# EAGLE design nrf51822-bo (EAGLE 6.5.0)
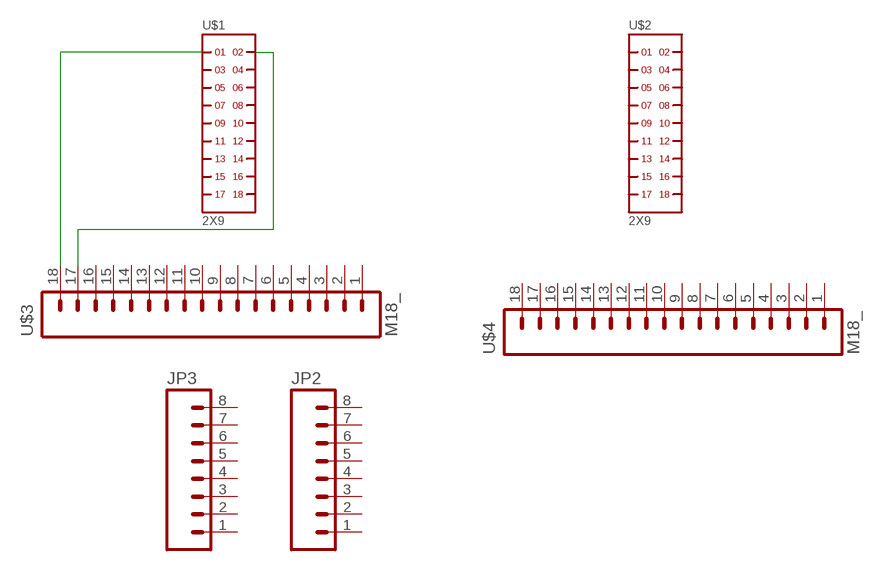
[diagram p0: schematic, sheet 1]

## Parts
JP2  M08  [1X08_PIN1_NO_SILK]
JP3  M08  [1X08_PIN1_NO_SILK]
U$1  2X9  [2X9]
U$2  2X9  [2X9]
U$3  M18_  [1X18]
U$4  M18_  [1X18]

## Nets
N$1: U$1.1 U$3.18
N$2: U$1.2 U$3.17
Unconnected: JP2.1 JP2.2 JP2.3 JP2.4 JP2.5 JP2.6 JP2.7 JP2.8 JP3.1 JP3.2 JP3.3 JP3.4 JP3.5 JP3.6 JP3.7 JP3.8 U$1.3 U$1.4 U$1.5 U$1.6 U$1.7 U$1.8 U$1.9 U$1.10 U$1.11 U$1.12 U$1.13 U$1.14 U$1.15 U$1.16 U$1.17 U$1.18 U$2.1 U$2.2 U$2.3 U$2.4 U$2.5 U$2.6 U$2.7 U$2.8 U$2.9 U$2.10 U$2.11 U$2.12 U$2.13 U$2.14 U$2.15 U$2.16 U$2.17 U$2.18 U$3.1 U$3.2 U$3.3 U$3.4 U$3.5 U$3.6 U$3.7 U$3.8 U$3.9 U$3.10 U$3.11 U$3.12 U$3.13 U$3.14 U$3.15 U$3.16 U$4.1 U$4.2 U$4.3 U$4.4 U$4.5 U$4.6 U$4.7 U$4.8 U$4.9 U$4.10 U$4.11 U$4.12 U$4.13 U$4.14 U$4.15 U$4.16 U$4.17 U$4.18

## Library data of the parts
JP2 JP3 = SparkFun-Connectors:M08: Header 8 Standard 8-pin 0.1" header. Use with straight break away headers (SKU : PRT-00116), right angle break away headers (PRT-00553), swiss pins (PRT-00743), machine pins (PRT-00117), and female headers (PRT-00115).
U$1 U$2 = headers(2mm):2X9
U$3 U$4 = SparkFun-Connectors:M18: 1x18 .1" header

## Board
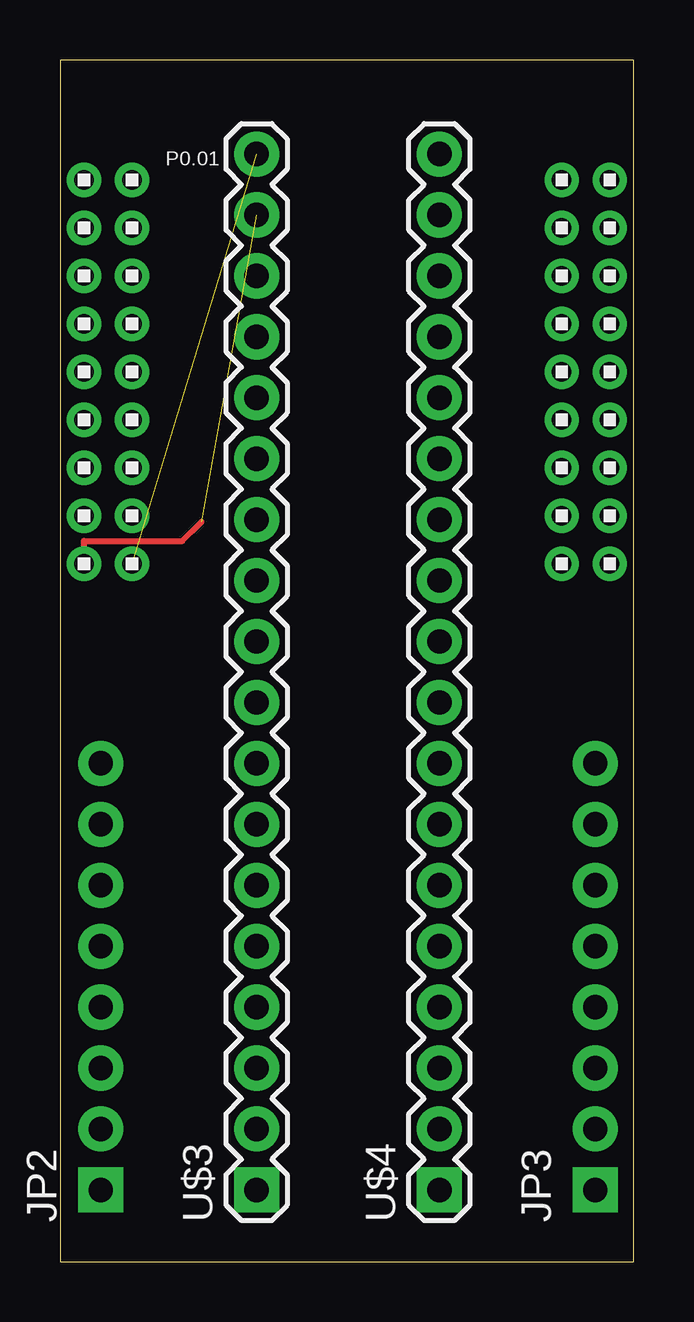
[diagram p1: board, top side]

Size 23.9 x 50.1 mm. Coordinates in mm from the lower left corner, seen from the top.
Outline: 0,0 23.9,0 23.9,50.1 0,50.1 0,0
Copper layers (1*16): Top 0.035mm / dielectric 1.5mm / Bottom 0.035mm
Design rules "default": minimum track width 10mil, minimum drill 24mil, track to track 8mil, track to pad 8mil, pad to pad 8mil, via to via 8mil, smd to smd 8mil, copper to edge 40mil, drill to drill 8mil, minimum pad ring 10mil, minimum via ring 8mil, stop-mask expansion 4mil, vias tented up to drill 0mil, thermal gap 10mil

### Footprints (pad centres in the part's own frame; a part is rotated, then mirrored left to right if it is on the bottom)
1X08_PIN1_NO_SILK = drill 1.016 pad 1.88 square: 1 0,0 | drill 1.016 pad 1.88: 2 2.54,0; 3 5.08,0; 4 7.62,0; 5 10.16,0; 6 12.7,0; 7 15.24,0; 8 17.78,0
2X9 = drill 0.8 pad 1.422: 1 -8,-1; 2 -8,1; 3 -6,-1; 4 -6,1; 5 -4,-1; 6 -4,1; 7 -2,-1; 8 -2,1; 9 0,-1; 10 0,1; 11 2,-1; 12 2,1; 13 4,-1; 14 4,1; 15 6,-1; 16 6,1; 17 8,-1; 18 8,1
1X18 = drill 1.016 pad 1.88 square: 1 0,0 | drill 1.016 pad 1.88: 2 2.54,0; 3 5.08,0; 4 7.62,0; 5 10.16,0; 6 12.7,0; 7 15.24,0; 8 17.78,0; 9 20.32,0; 10 22.86,0; 11 25.4,0; 12 27.94,0; 13 30.48,0; 14 33.02,0; 15 35.56,0; 16 38.1,0; 17 40.64,0; 18 43.18,0

### Placement (x,y rotation side)
JP2  1.7,3 90 top
JP3  22.3,3 90 top
U$1  2,37.1 90 top
U$2  21.9,37.1 90 top
U$3  8.19,3 90 top
U$4  15.81,3 90 top

### Tracks (layer width: path | path; a pad name or v marks a point on that pad's centre or on a via)
N$1  (1 unrouted)
N$2  (1 unrouted)
  Top 0.254: U$1.2 1,30.05 5.1,30.05 5.9,30.85

### Text on the board
tNames: P0.01